# EAGLE schematic astable multivibrator (EAGLE 9.6.2)
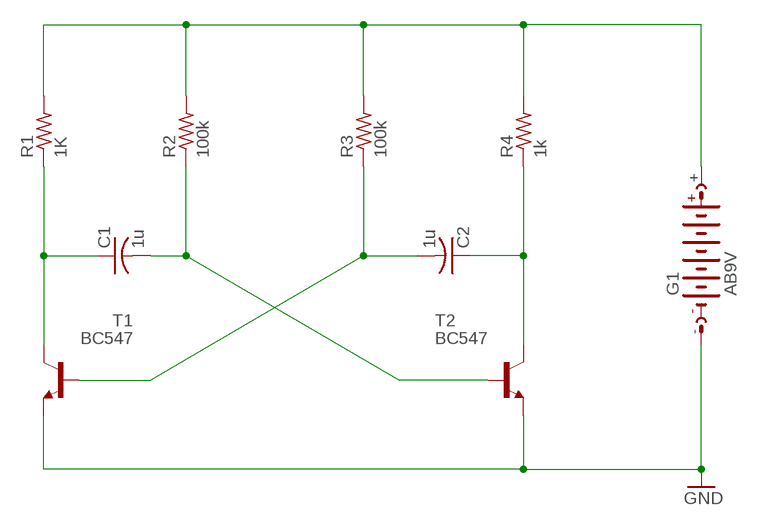
[diagram p0: schematic, sheet 1]

## Parts
C1  1u  C-USC0805  [C0805]
C2  1u  C-USC0805  [C0805]
G1  AB9V  [AB9V]
R1  1K  R-US_R0805  [R0805]
R2  100k  R-US_R0805  [R0805]
R3  100k  R-US_R0805  [R0805]
R4  1k  R-US_R0805  [R0805]
T1  BC547  [TO92]
T2  BC547  [TO92]

## Nets
GND: G1.- T1.1(E) T2.1(E)
N$1: G1.+ R1.2 R2.2 R3.2 R4.2
N$2: C2.2 R3.1 T1.2(B)
N$3: C1.2 R2.1 T2.2(B)
N$7: C1.1 R1.1 T1.3(C)
N$8: C2.1 R4.1 T2.3(C)

## Library data of the parts
C1 C2 = rcl:C-US: CAPACITOR, American symbol; SPICEPREFIX: C
G1 = battery:AB9V: 9-V BATTERY CLIP
R1-R4 = rcl:R-US_: RESISTOR, American symbol; SPICEPREFIX: R
T1 T2 = transistor:BC547: NPN TRANSISTOR